# Altium project Sensorbox_Hub_ESP32.PrjPcb
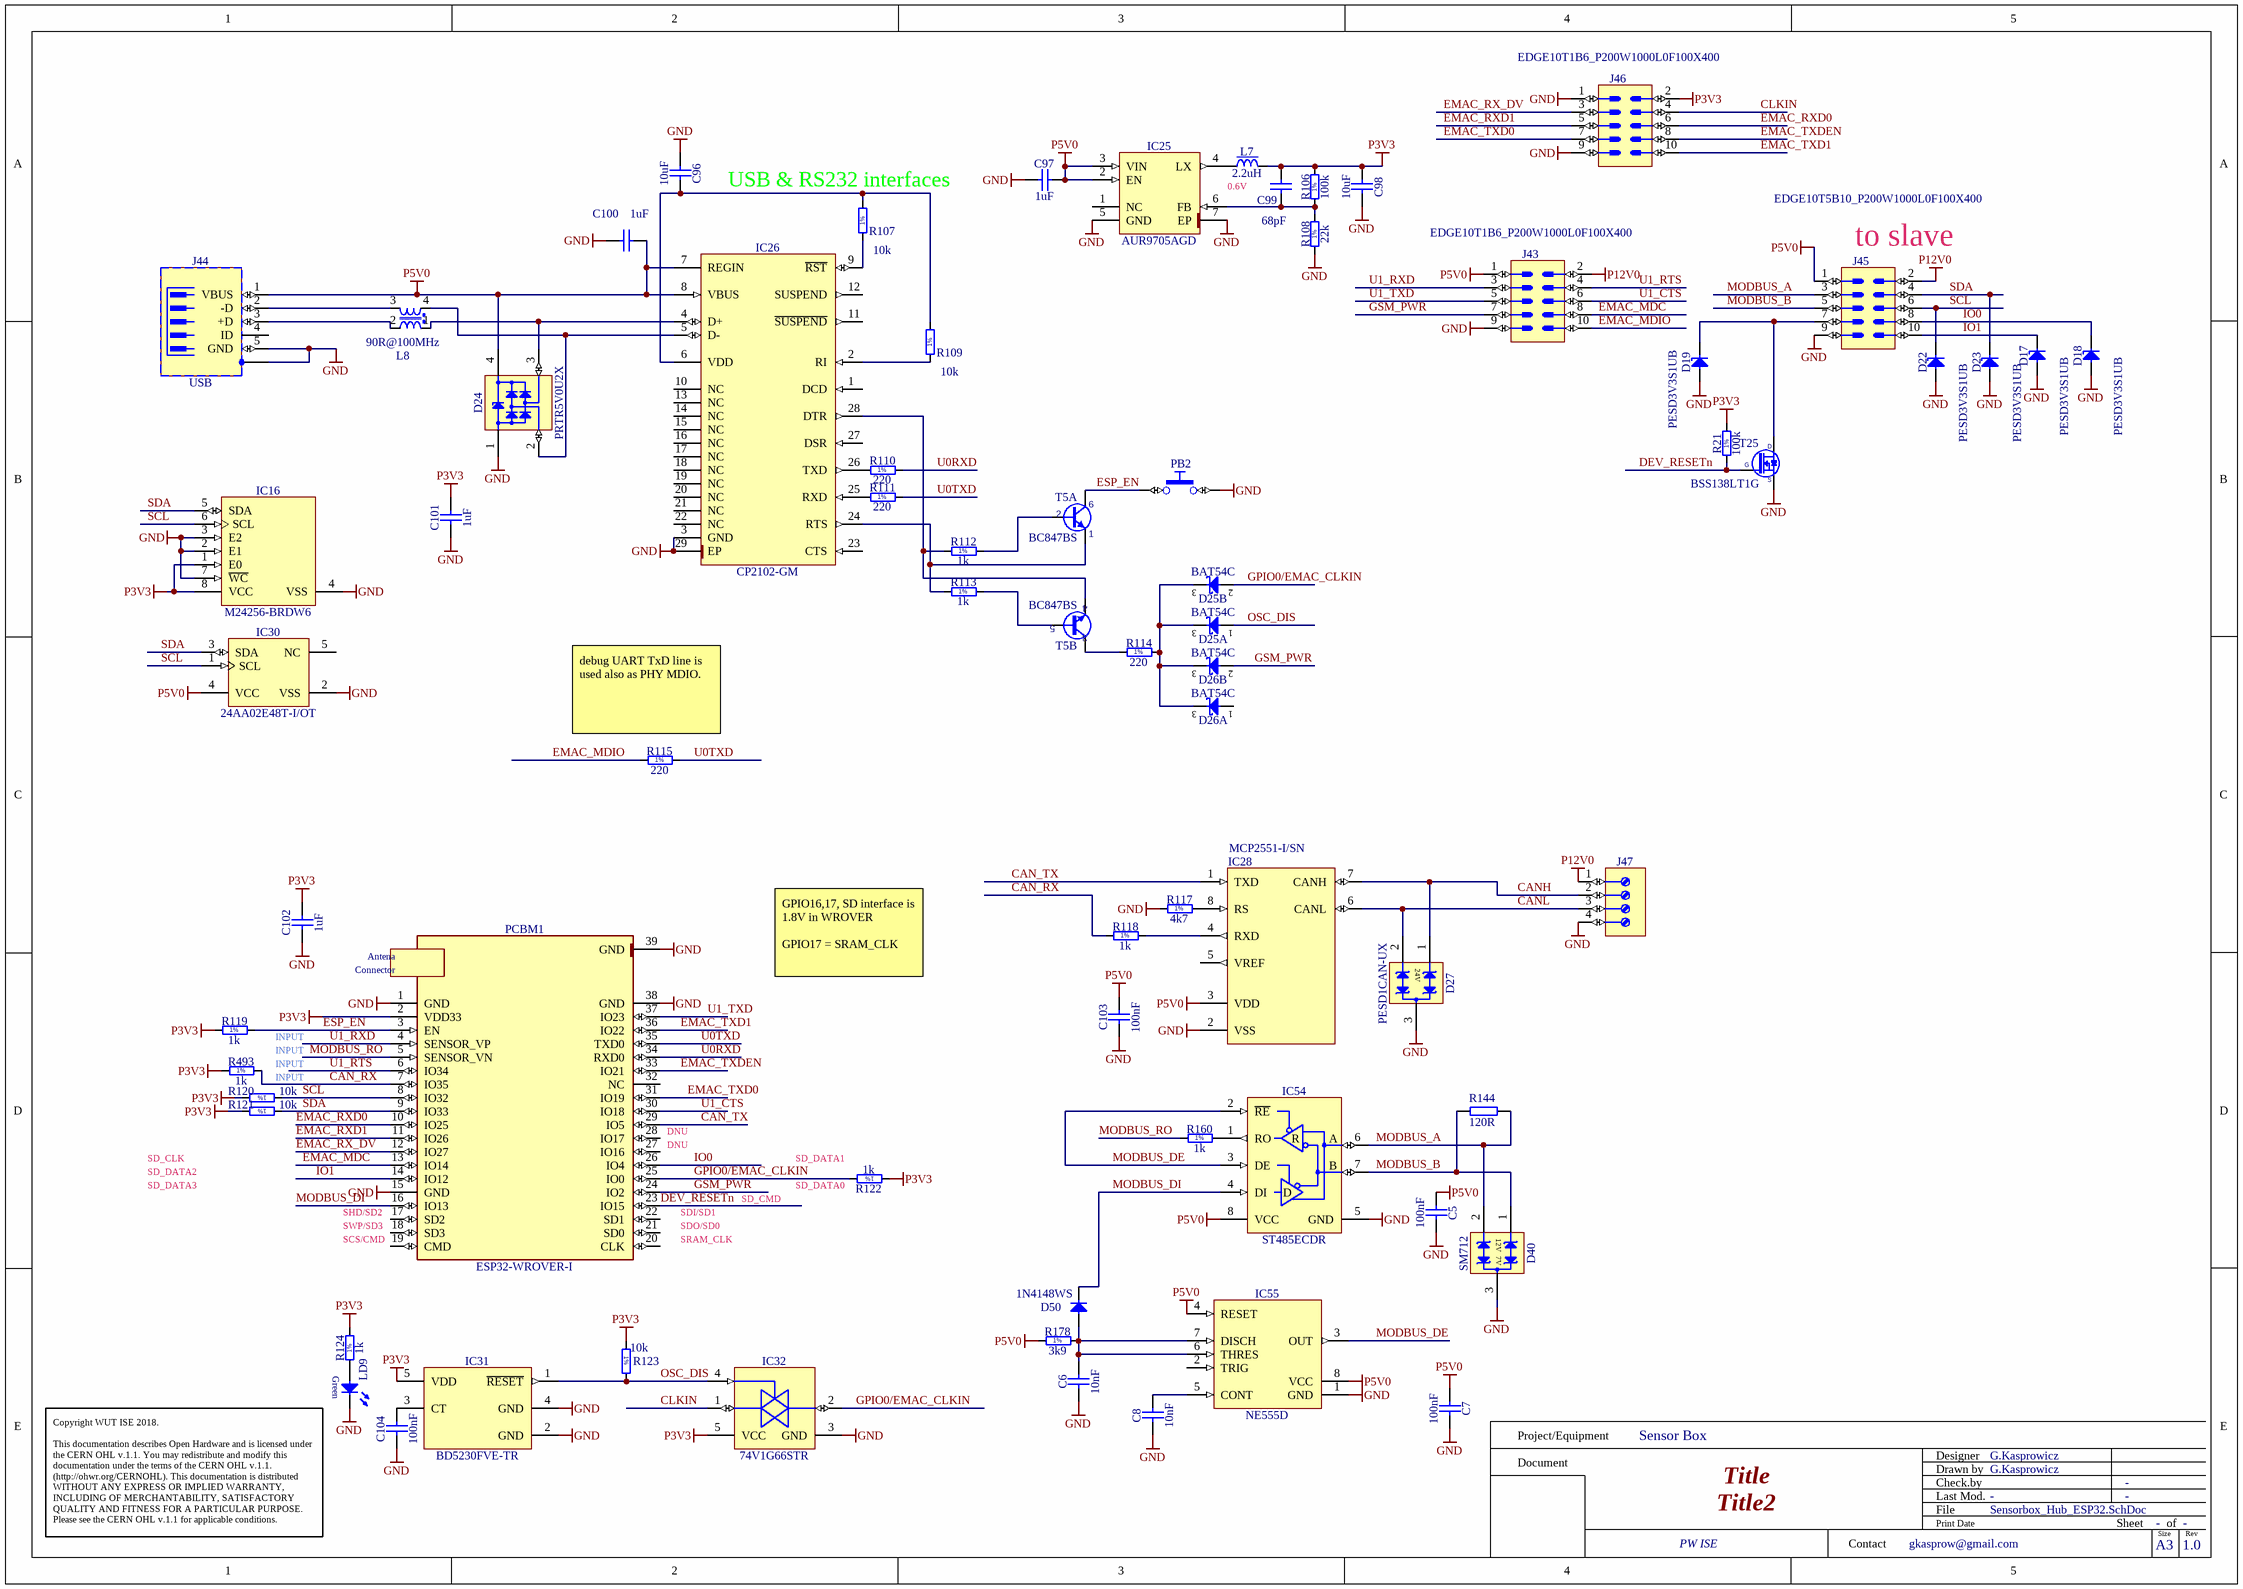
[diagram p0: Sensorbox_Hub_ESP32.SchDoc]
1 sheet, 68 parts. Net scope: global (net labels, ports and power ports of the same name join across sheets).
Board file: Sensorbox_Hub_ESP32.PCBDOC

## Sheet Sensorbox_Hub_ESP32.SchDoc: Title
size 420 x 297 mm; Author: G.Kasprowicz; CompanyName: WUT ISE; DrawnBy: G.Kasprowicz; Organization: WUT ISE; Address1: PW ISE; Address2: Nowowiejska 15/19 00-665 Warsaw; Address3: gkasprow@gmail.com; Revision: 1.0; SheetNumber: -; SheetTotal: -; ModifiedBy: -; CheckedDate: -; Title2: Title2; DivGrp: WUT ISE; Designer: G.Kasprowicz; ModifiedDate: -; ProjectName: Sensor Box

### Parts
C5  100nF  [CAPC1005X55N]
C6  10nF  [CAPC1608X87N]
C7  100nF  [CAPC1005X55N]
C8  10nF  [CAPC1608X87N]
C96  10uF  [CAPC2012X135N]
C97  1uF  [CAPC1005X55N]
C98  10uF  [CAPC2012X135N]
C99  68pF  [CAPC1608X87N]
C100  1uF  [CAPC1608X87N]
C101  1uF  [CAPC1005X55N]
C102  1uF  [CAPC1005X55N]
C103  100nF  [CAPC1005X55N]
C104  100nF  [CAPC1005X55N]
D17  PESD3V3S1UB  [SODFL1608X65N]
D18  PESD3V3S1UB  [SODFL1608X65N]
D19  PESD3V3S1UB  [SODFL1608X65N]
D22  PESD3V3S1UB  [SODFL1608X65N]
D23  PESD3V3S1UB  [SODFL1608X65N]
D24  PRTR5V0U2X  [SOT190P230X110-4N]
D25  BAT54C  [SOT95P240X130-3N]  (parts A,B of 2)
D26  BAT54C  [SOT95P240X130-3N]  (parts A,B of 2)
D27  PESD1CAN-UX  [SOT95P237X112-3N]
D40  SM712  [SOT95P237X112-3N]
D50  1N4148WS  [SODFL2512X100N]
IC16  M24256-BRDW6  [SOP65P640X120-8N]
IC25  AUR9705AGD  [SON65P200X200X80-7N-R65X145]
IC26  CP2102-GM  [QFN50P500X500X100-29N-S335]
IC28  MCP2551-I/SN  [SOIC127P600X175-8N]
IC30  24AA02E48T-I/OT  [SOT95P280X145-5N]
IC31  BD5230FVE-TR  [SOT95P280X145-5N]
IC32  74V1G66STR  [SOT95P280X145-5N]
IC54  ST485ECDR  [SOIC127P600X175-8N]
IC55  NE555D  [SOIC127P600X175-8N]
J43  (no value)  [EDGE10T1B6_P200W1000L0F100X400]
J44  USB  [MOLEX_105133-0011]
J45  (no value)  [EDGE10T5B10_P200W1000L0F100X400]
J46  (no value)  [EDGE10T1B6_P200W1000L0F100X400]
J47  (no value)  [PHOENIX_1725672]
L7  2.2uH  [IND_MURATA_LQH44PN_P0]
L8  90R@100MHz  [IND_MURATA_DLW21S]
LD9  Green  [LED_KINGBRIGHT_KPTR3216]  (value not drawn)
PB2  Push Button  [PB_TYCO_FSMSM]  (value not drawn)
PCBM1  ESP32-WROVER-I  [PCBM_ESP32-WROVER-I]
R21  100k  [RESC1005X40N]
R106  100k  [RESC1005X40N]
R107  10k  [RESC1005X40N]
R108  22k  [RESC1005X40N]
R109  10k  [RESC1005X40N]
R110  220  [RESC1005X40N]
R111  220  [RESC1005X40N]
R112  1k  [RESC1005X40N]
R113  1k  [RESC1005X40N]
R114  220  [RESC1005X40N]
R115  220  [RESC1005X40N]
R117  4k7  [RESC1005X40N]
R118  1k  [RESC1005X40N]
R119  1k  [RESC1005X40N]
R120  10k  [RESC1005X40N]
R121  10k  [RESC1005X40N]
R122  1k  [RESC1005X40N]
R123  10k  [RESC1005X40N]
R124  1k  [RESC1005X40N]
R144  120R  [1206R]
R160  1k  [RESC1005X40N]
R178  3k9  [RESC1005X40N]
R493  1k  [RESC1005X40N]
T5  BC847BS  [SOT65P210X110-6N]  (parts A,B of 2)
T25  BSS138LT1G  [SOT95P240X110-3N]

### Nets
GND: C5.2 C6.1 C7.2 C8.1 C96.1 C97.1 C98.2 C100.2 C101.1 C102.1 C103.1 C104.1 D17.2(A) D18.2(A) D19.2(A) D22.2(A) D23.2(A) D24.1(GND) D27.3(GND) D40.3(GND) IC16.2(E1) IC16.3(E2) IC16.4(VSS) IC16.7(~{WC}) IC25.5(GND) IC25.7(EP) IC26.3(GND) IC26.29(EP) IC28.2(VSS) IC30.2(VSS) IC31.2(GND) IC31.4(GND) IC32.3(GND) IC54.5(GND) IC55.1(GND) J43.9 J44.5(GND) J44.6(SH) J45.9 J46.1 J46.9 J47.4 LD9.1(C) PB2.2 PCBM1.1(GND) PCBM1.15(GND) PCBM1.38(GND) PCBM1.39(GND) R108.1 R117.1 T25.2(S)
P3V3: C98.1 C99.2 C101.2 C102.2 IC16.1(E0) IC16.8(VCC) IC31.5(VDD) IC32.5(VCC) J46.2 L7.2 PCBM1.2(VDD33) R21.2 R106.2 R119.1 R120.2 R121.2 R122.1 R123.1 R124.2 R493.1
P5V0: C5.1 C7.1 C97.2 C100.1 C103.2 D24.4(VCC) IC25.2(EN) IC25.3(VIN) IC26.7(REGIN) IC26.8(VBUS) IC28.3(VDD) IC30.4(VCC) IC54.8(VCC) IC55.4(RESET) IC55.8(VCC) J43.1 J44.1(VBUS) J45.1 R178.1
P12V0: J43.2 J45.2 J47.1
CAN_RX: PCBM1.7(IO35) R118.1 R493.2
CAN_TX: IC28.1(TXD) PCBM1.29(IO5)
CANH: D27.1(I/O1) IC28.7(CANH) J47.2
CANL: D27.2(I/O2) IC28.6(CANL) J47.3
CLKIN: IC32.1(D0) J46.4
DEV_RESETn: PCBM1.23(IO15) R21.1 T25.1(G)
EMAC_MDC: J43.8 PCBM1.13(IO14)
EMAC_MDIO: J43.10 R115.1
EMAC_RX_DV: J46.3 PCBM1.12(IO27)
EMAC_RXD0: J46.6 PCBM1.10(IO25)
EMAC_RXD1: J46.5 PCBM1.11(IO26)
EMAC_TXD0: J46.7 PCBM1.31(IO19)
EMAC_TXD1: J46.10 PCBM1.36(IO22)
EMAC_TXDEN: J46.8 PCBM1.33(IO21)
ESP_EN: PB2.1 PCBM1.3(EN) R119.2 T5.6(C)
GPIO0/EMAC_CLKIN: D25.2(A) IC32.2(~{D0}) PCBM1.25(IO0) R122.2
GSM_PWR: D26.2(A) J43.7 PCBM1.24(IO2)
IO0: D18.1(C) J45.8 PCBM1.26(IO4)
IO1: D17.1(C) J45.10 PCBM1.14(IO12)
MODBUS_A: D40.2(I/O2) IC54.6(A) J45.3 R144.2
MODBUS_B: D40.1(I/O1) IC54.7(B) J45.5 R144.1
MODBUS_DE: IC54.2(~{RE}) IC54.3(DE) IC55.3(OUT)
MODBUS_DI: D50.1(C) IC54.4(DI) PCBM1.16(IO13)
MODBUS_RO: PCBM1.5(SENSOR_VN) R160.1
OSC_DIS: D25.1(A) IC31.1(~{RESET}) IC32.4(~{D1}) R123.2
SCL: D22.1(C) IC16.6(SCL) IC30.1(SCL) J45.6 PCBM1.8(IO32) R120.1
SDA: D23.1(C) IC16.5(SDA) IC30.3(SDA) J45.4 PCBM1.9(IO33) R121.1
U0RXD: PCBM1.34(RXD0) R110.2
U0TXD: PCBM1.35(TXD0) R111.2 R115.2
U1_CTS: J43.6 PCBM1.30(IO18)
U1_RTS: J43.4 PCBM1.6(IO34)
U1_RXD: J43.3 PCBM1.4(SENSOR_VP)
U1_TXD: J43.5 PCBM1.37(IO23)
NetC6_2: C6.2 D50.2(A) IC55.6(THRES) IC55.7(DISCH) R178.2
NetC8_2: C8.2 IC55.5(CONT)
NetC96_2: C96.2 IC26.6(VDD) R107.2 R109.2
NetC99_1: C99.1 IC25.6(FB) R106.1 R108.2
NetC104_2: C104.2 IC31.3(CT)
NetD19_1: D19.1(C) J45.7 T25.3(D)
NetD24_2: D24.2(I/O1) IC26.5(D-) L8.4
NetD24_3: D24.3(I/O2) IC26.4(D+) L8.1
NetD25_3: D25.3(COMC) D26.3(COMC) R114.2
NetIC25_4: IC25.4(LX) L7.1
NetIC26_2: IC26.2(RI) R109.1
NetIC26_9: IC26.9(~{RST}) R107.1
NetIC26_24: IC26.24(RTS) R113.1 T5.1(E)
NetIC26_25: IC26.25(RXD) R111.1
NetIC26_26: IC26.26(TXD) R110.1
NetIC26_28: IC26.28(DTR) R112.1 T5.4(E)
NetIC28_4: IC28.4(RXD) R118.2
NetIC28_8: IC28.8(RS) R117.2
NetIC54_1: IC54.1(RO) R160.2
NetJ44_2: J44.2(-D) L8.3
NetJ44_3: J44.3(+D) L8.2
NetLD9_2: LD9.2(A) R124.1
NetR112_2: R112.2 T5.2(B)
NetR113_2: R113.2 T5.5(B)
NetR114_1: R114.1 T5.3(C)

Not connected (* = marked no-connect by the designer): D26 1(A); IC25 1(NC); IC26 1(DCD) 10(NC) 11(~{SUSPEND}) 12(SUSPEND) 13(NC) 14(NC) 15(NC) 16(NC) 17(NC) 18(NC) 19(NC) 20(NC) 21(NC) 22(NC) 23(CTS) 27(DSR); IC28 5(VREF); IC30 5(NC); IC55 2(TRIG); J44 4(ID); PCBM1 17(SD2) 18(SD3) 19(CMD) 20(CLK) 21(SD0) 22(SD1) 27(IO16) 28(IO17) 32(NC)

### Notes on the sheet
- (near R107) USB & RS232 interfaces
- 0.6V
- (near J45) to slave
- (near R115) debug UART TxD line is used also as PHY MDIO.
- GPIO16,17, SD interface is 1.8V in WROVER
  GPIO17 = SRAM_CLK
- INPUT
- (near PCBM1) DNU
- SD_DATA2
- SD_DATA3
- SD_CLK
- SD_CMD
- (near R122) SD_DATA0
- (near R122) SD_DATA1
- (near PCBM1) SCS/CMD
- (near PCBM1) SWP/SD3
- (near PCBM1) SHD/SD2
- (near PCBM1) SDO/SD0
- (near PCBM1) SRAM_CLK
- (near PCBM1) SDI/SD1
- Project/Equipment
- Document
- Designer
- Drawn by
- Check.by
- Copyright WUT ISE 2018.
  This documentation describes Open Hardware and is licensed under the CERN OHL v.1.1. You may redistribute and modify this documentation under the terms of the CERN OHL v.1.1. (http://ohwr.org/CERNOHL). This documentation is distributed WITHOUT ANY EXPRESS OR IMPLIED WARRANTY, INCLUDING OF MERCHANTABILITY, SATISFACTORY QUALITY AND FITNESS FOR A PARTICULAR PURPOSE. Please see the CERN OHL v.1.1 for applicable conditions.
- Contact
- File
- Last Mod.
- Print Date
- Sheet
- Size
- A3
- of
- Rev
- (in symbol PCBM_ESP32-WROVER-I) Antena; Connector
- (in symbol R0402_1K_1%_0.0625W_100PPM) 1%
- (in symbol R0402_3K9_1%_0.0625W_100PPM) 1%
- (in symbol R0402_4K7_1%_0.0625W_100PPM) 1%
- (in symbol R0402_10K_1%_0.0625W_100PPM) 1%
- (in symbol R0402_22K_1%_0.0625W_100PPM) 1%
- (in symbol R0402_100K_1%_0.0625W_100PPM) 1%
- (in symbol R0402_220R_1%_0.0625W_100PPM) 1%
- (in symbol SM712) 12V; 7V
- (in symbol ST485ECDR) R; D

### Library data of the parts
C5 C7 = CC0402_100NF_16V_10%_X7R: Non-polarised capacitor; Part Description: SMD Multilayer Chip Ceramic Capacitor; Manufacturer: GENERIC; Manufacturer1 Part Number: GRM155R71C104KA88D; Voltage: 16V; TC: X7R; Tolerance: ±10%; Part Number: CC0402_100NF_16V_10%_X7R; Component Kind: Standard; Component Type: Standard; Pin Count: 2; Value: 100nF; Status: Not Recommended; Manufacturer Part Number: CC0402_100NF_16V_10%_X7R; Case: 0402; Mounted: Yes; Socket: No; SMD: Yes; Manufacturer1 Example: MURATA; Manufacturer1 ComponentHeight: 0.55mm; HelpURL: \\cern.ch\dfs\Applications\Altium\Datasheets\CC0402_X7R_MURATA_GRM.pdf; Author: CERN DEM JLC; CreateDate: 05.12.2013; LatestRevisionDate: 03.12.2007; Sense: No
C6 C8 = CC0603_10NF_50V_5%_C0G: Non-polarised capacitor; Part Description: SMD Multilayer Chip Ceramic Capacitor; Manufacturer: GENERIC; Manufacturer1 Part Number: C1608C0G1H103J080AA; Voltage: 50V; TC: C0G/NP0; Tolerance: ±5%; Part Number: CC0603_10NF_50V_5%_C0G; Component Kind: Standard; Component Type: Standard; Pin Count: 2; Value: 10nF; Status: Preferred; Manufacturer Part Number: CC0603_10NF_50V_5%_C0G; Case: 0603; Mounted: Yes; Socket: No; SMD: Yes; Sense: No; Manufacturer1 Example: TDK; Manufacturer1 ComponentHeight: 0.9mm; HelpURL: \\cern.ch\dfs\Applications\Altium\Datasheets\CC0603_C0G_TDK_C.pdf; Author: CERN DEM JLC; CreateDate: 10.12.2014; LatestRevisionDate: 10.12.2014
C96 C98 = CC0805_10UF_16V_10%_X5R: Non-polarised capacitor; Part Description: SMD Multilayer Chip Ceramic Capacitor; Manufacturer: GENERIC; Manufacturer1 Part Number: C0805C106K4PAC; Voltage: 16V; TC: X5R; Tolerance: ±10%; Part Number: CC0805_10UF_16V_10%_X5R; Component Kind: Standard; Component Type: Standard; Pin Count: 2; Value: 10uF; Status: Preferred; Manufacturer Part Number: CC0805_10UF_16V_10%_X5R; Case: 0805; Mounted: Yes; Socket: No; SMD: Yes; Manufacturer1 Example: KEMET; Manufacturer1 ComponentHeight: 1.4mm; HelpURL: \\cern.ch\dfs\Applications\Altium\Datasheets\CC1206_X5R_KEMET.pdf; Author: CERN DEM JLC; CreateDate: 03.12.2007; LatestRevisionDate: 03.12.2007; Sense: No
C97 C101 C102 = CC0402_1UF_16V_10%_X5R: Non-polarised capacitor; Part Description: SMD Multilayer Chip Ceramic Capacitor; Manufacturer: GENERIC; Manufacturer1 Part Number: C1005X5R1C105KT; Voltage: 16V; TC: X5R; Tolerance: ±10%; Part Number: CC0402_1UF_16V_10%_X5R; Component Kind: Standard; Component Type: Standard; Pin Count: 2; Value: 1uF; Status: Preferred; Manufacturer Part Number: CC0402_1UF_16V_10%_X5R; Case: 0402; Mounted: Yes; Socket: No; SMD: Yes; Sense: No; Manufacturer1 Example: TDK; Manufacturer1 ComponentHeight: 0.55mm; HelpURL: \\cern.ch\dfs\Applications\Altium\Datasheets\CC0402_X5R_TDK_C.pdf; Author: CERN DEM JLC; CreateDate: 25.10.2012; LatestRevisionDate: 25.10.2012
C99 = CC0603_68PF_50V_5%_NP0: Non-polarised capacitor; Part Description: SMD Multilayer Chip Ceramic Capacitor; Manufacturer: GENERIC; Manufacturer1 Part Number: 223886715689; Voltage: 50V; TC: C0G/NP0; Tolerance: ±5%; Part Number: CC0603_68PF_50V_5%_NP0; Component Kind: Standard; Component Type: Standard; Pin Count: 2; Value: 68pF; Status: Preferred; Manufacturer Part Number: CC0603_68PF_50V_5%_NP0; Case: 0603; Mounted: Yes; Socket: No; SMD: Yes; Sense: No; Manufacturer1 Example: PHYCOMP; Manufacturer1 ComponentHeight: 0.87mm; HelpURL: \\cern.ch\dfs\Applications\Altium\Datasheets\CC0603_NP0_PHYCOMP.pdf; Author: CERN DEM JLC; CreateDate: 03.12.2007; LatestRevisionDate: 03.12.2007
C100 = CC0603_1UF_25V_10%_X7R: Non-polarised capacitor; Part Description: SMD Multilayer Chip Ceramic Capacitor; Manufacturer: GENERIC; Manufacturer1 Part Number: GRM188R71E105KA12D; Voltage: 25V; TC: X7R; Tolerance: ±10%; Table: Capacitors SMD; Part Number: CC0603_1UF_25V_10%_X7R; Component Kind: Standard; Component Type: Standard; Pin Count: 2; Value: 1uF; Status: None; Manufacturer Part Number: CC0603_1UF_25V_10%_X7R; Case: 0603; Mounted: Yes; Socket: No; SMD: Yes; Manufacturer1 Example: MURATA; Manufacturer1 ComponentHeight: 0.9mm; HelpURL: \\cern.ch\dfs\Applications\Altium\Datasheets\CC0603_X7R_MURATA.pdf; Author: CERN DEM JLC; CreateDate: 2011-01-18; LatestRevisionDate: 2011-01-18
C103 C104 = CC0402_100NF_16V_10%_X5R: Non-polarised capacitor; Part Description: SMD Multilayer Chip Ceramic Capacitor; Manufacturer: GENERIC; Manufacturer1 Part Number: GRM155R61C104KA88D; Voltage: 16V; TC: X5R; Tolerance: ±10%; Part Number: CC0402_100NF_16V_10%_X5R; Component Kind: Standard; Component Type: Standard; Pin Count: 2; Value: 100nF; Status: None; Manufacturer Part Number: CC0402_100NF_16V_10%_X5R; Case: 0402; Mounted: Yes; Socket: No; SMD: Yes; Sense: No; Manufacturer1 Example: MURATA; Manufacturer1 ComponentHeight: 0.55mm; HelpURL: \\cern.ch\dfs\Applications\Altium\Datasheets\CC0402_X5R_MURATA_GRM.pdf; Author: CERN DEM JLC; CreateDate: 10.12.2013; LatestRevisionDate: 10.12.2013
D17-D19 D22 D23 = PESD3V3S1UB: ESD protection diode; Part Description: ESD protection diode (23kV); Manufacturer: NXP SEMICONDUCTORS; Voltage: 3V3; Power: 330W; PressFit: No; Bonding: No; Part Number: PESD3V3S1UB; Component Kind: Standard; Component Type: Standard; Device: PESD3V3S1UB; PackageDescription: Ultra Small Outline Diode Flat Lead (SOD-523), Body; 1.2mm L X 0.8mm W X 0.65mm H, IPC Medium Density; Manufacturer Part Number: PESD3V3S1UB; Pin Count: 2; Case: SOD523; Mounted: Yes; Socket: No; SMD: Yes; Sense: No; ComponentHeight: 0.65mm; HelpURL: \\cern.ch\dfs\Applications\Altium\Datasheets\PESD3V3S1UB.pdf; Author: CERN DEM JLC; CreateDate: 29.11.2012; LatestRevisionDate: 29.11.2012
D24 = PRTR5V0U2X: Ultra Low Capacitance Double Rail-to-Rail ESD Protection Diode; Part Description: Ultra Low Capacitance (1pF) Double Rail-to-Rail ESD Protection Diode (8kV); Manufacturer: NXP SEMICONDUCTORS; Voltage: 5.5V; PressFit: No; Bonding: No; Table: Diodes; Part Number: PRTR5V0U2X; Component Kind: Standard; Component Type: Standard; Device: PRTR5V0U2X; PackageDescription: SOT143B, SOT, 1.90mm Pitch; 4 Pin, 1.30mm W X 2.90mm L X 1.10mm H body, IPC Medium Density; Manufacturer Part Number: PRTR5V0U2X; Pin Count: 4; Case: SOT143B; Mounted: Yes; Socket: No; SMD: Yes; ComponentHeight: 1.1mm; HelpURL: \\cern.ch\dfs\Applications\Altium\Datasheets\PRTR5V0U2X.pdf; Author: CERN DEM JLC; CreateDate: 2011-03-22; LatestRevisionDate: 2011-03-22
D25 D26 = BAT54C: Dual Common Cathode Schottky Diodes; Part Description: Dual Common Cathode Small Signal Schottky Diode; Manufacturer: FAIRCHILD SEMICONDUCTOR; Voltage: 30V; Power: 200mA; PressFit: No; Bonding: No; Part Number: BAT54C; Component Kind: Standard; Component Type: Standard; Device: BAT54C; PackageDescription: SOT23 3-Leads, Pitch 0.95mm - Body 1.3x2.9mm, IPC Medium Density; Manufacturer Part Number: BAT54C; Pin Count: 3; Case: SOT23-3; Mounted: Yes; Socket: No; SMD: Yes; Sense: No; ComponentHeight: 1.30mm; HelpURL: \\cern.ch\dfs\Applications\Altium\Datasheets\BAT54C.pdf; Author: CERN DEM JLC; CreateDate: 17.09.2009; LatestRevisionDate: 27.05.2010
D27 = D_TVS_PESD1CAN: TVS Diode for CAN; Manufacturer: Nexperia; Voltage: 24V; Power: 400W; PressFit: No; Bonding: No; Part Number: PESD1CAN-UX; Component Kind: Standard; Component Type: Standard; Device: PESD1CAN-UX; PackageDescription: SOT, 0.95mm, pitch; 3 pin,1.30mm W X 2.92mm L X 1.12mm H body, IPC Medium Density; Part Description: TVS Diode for CAN; Manufacturer Part Number: PESD1CAN-UX; Pin Count: 3; Case: SOT-23; Mounted: Yes; Socket: No; SMD: Yes; Sense: No; ComponentHeight: 1.12mm; HelpURL: \\cern.ch\dfs\Applications\Altium\Datasheets\SM712.TCT.pdf; Author: CERN DEM JLC; CreateDate: 03.09.2014; LatestRevisionDate: 13.01.2015
D40 = SM712: Asymmetrical TVS Diode for Extended Common-Mode RS-485; Manufacturer: SEMTECH; Voltage: 12V/-7V; Power: 400W; PressFit: No; Bonding: No; Part Number: SM712; Component Kind: Standard; Component Type: Standard; Device: SM712; PackageDescription: SOT, 0.95mm, pitch; 3 pin,1.30mm W X 2.92mm L X 1.12mm H body, IPC Medium Density; Status: Obsolete; Part Description: Asymmetrical TVS Diode for Extended Common-Mode RS-485; Manufacturer Part Number: SM712; Pin Count: 3; Case: SOT-23; Mounted: Yes; Socket: No; SMD: Yes; Sense: No; ComponentHeight: 1.12mm; HelpURL: \\cern.ch\dfs\Applications\Altium\Datasheets\SM712.pdf; Author: CERN DEM JLC; CreateDate: 23.04.2012; LatestRevisionDate: 23.04.2012
D50 = 1N4148WS: Diode; Part Description: Small Signal Diodes; Manufacturer: FAIRCHILD SEMICONDUCTOR; Voltage: 75V; Power: 150mA; PressFit: No; Bonding: No; Part Number: 1N4148WS; Component Kind: Standard; Component Type: Standard; Device: 1N4148WS; PackageDescription: SODFL Diode; 1.70mm W X 1.25mm L X 1.00mm H body, IPC Medium Density; Manufacturer Part Number: 1N4148WS; Pin Count: 2; Case: SOD-323F; Mounted: Yes; Socket: No; SMD: Yes; Sense: No; ComponentHeight: 1mm; HelpURL: \\cern.ch\dfs\Applications\Altium\Datasheets\1N4148WS.pdf; Author: CERN DEM JLC; CreateDate: 12.05.2011; LatestRevisionDate: 12.05.2011
IC16 = MEM_M24256-BRDW6P: 256-Kbit Serial I²C Bus EEPROM; Manufacturer: ST MICROELECTRONICS; PressFit: No; Bonding: No; Part Number: M24256-BRDW6P; Component Kind: Standard; Component Type: Standard; Device: M24256-BRDW6; PackageDescription: SOP, 0.65mm pitch; 8 pin, 4.40mm W X 3.00mm L X 1.20mm H body, IPC Medium Density; Part Description: 256-Kbit Serial I²C Bus EEPROM; Manufacturer Part Number: M24256-BRDW6; Pin Count: 8; Case: TSSOP8; Mounted: Yes; Socket: No; SMD: Yes; Sense: No; ComponentHeight: 1.2mm; HelpURL: \\cern.ch\dfs\Applications\Altium\Datasheets\M24256-BRDW6P.pdf; Author: CERN DEM MR; CreateDate: 17.03.2016; LatestRevisionDate: 17.03.2016
IC25 = AUR9705AGD: 0V to 6V Input, 1A, 1.5MHz, Step-Down DC-DC Converter; Manufacturer: DIODES INCORPORATED; PressFit: No; Bonding: No; Part Number: AUR9705AGD; Component Kind: Standard; Component Type: Standard; Device: AUR9705AGD; PackageDescription: SON, 0.65mm Pitch, 6 Pin, 2.00mm W X 2.00mm L X 0.80mm H body (W/Thermal Tab 0.65mm X 1.45mm), IPC Medium Density; Part Description: 0V to 6V Input, 1A, 1.5MHz, Step-Down DC-DC Converter; Manufacturer Part Number: AUR9705AGD; Pin Count: 7; Case: SON6; Mounted: Yes; Socket: No; SMD: Yes; Sense: No; ComponentHeight: 0.8mm; HelpURL: \\cern.ch\dfs\Applications\Altium\Datasheets\AUR9705AGD.pdf; Author: CERN DEM MR; CreateDate: 15.02.2018; LatestRevisionDate: 15.02.2018
IC26 = CP2102-GM: Single-Chip USB to UART Bridge; Manufacturer: SILICON LABS; Table: Analog & Interface; Part Number: CP2102-GM; Component Kind: Standard; Component Type: Standard; Device: CP2102-GM; PackageDescription: QFN, 0.50mm Pitch, Square; 28 pin, 5.00mm L X 5.00mm W X 1.00mm H body (w/thermal tab 3.35 X 3.35mm),  IPC Medium Density; Part Description: Single-Chip USB to UART Bridge; Manufacturer Part Number: CP2102-GM; Pin Count: 29; Case: QFN28; Mounted: Yes; Socket: No; SMD: Yes; ComponentHeight: 1.0mm; Author: CERN DEM JLC; HelpURL: \\cern.ch\dfs\Applications\Altium\Datasheets\CP2102-GM.pdf; CreateDate: 2011-03-03; LatestRevisionDate: 2011-03-03
IC28 = IFC_MCP2551: High-Speed CAN Transceiver, 8-Pin SOIC, Industrial Temperature; Manufacturer: MICROCHIP TECHNOLOGY; PressFit: No; Bonding: No; Part Number: MCP2551-I/SN; Component Kind: Standard; Component Type: Standard; Device: MCP2551-I/SN; PackageDescription: SOIC 8, Pitch 1.27mm - Body 4x5mm, IPC Medium Density; Part Description: High-Speed CAN Transceiver; Manufacturer Part Number: MCP2551-I/SN; Pin Count: 8; Case: SOIC8; Mounted: Yes; Socket: No; SMD: Yes; Sense: No; ComponentHeight: 1.75mm; Author: GK; CreateDate: 07.09.2016; LatestRevisionDate: 07.09.2016
IC30 = 24AA02E48T-I/OT: 1.7V-5.5V, 2K I2C Serial EEPROM With EUI-48 Node Identity; Manufacturer: MICROCHIP TECHNOLOGY; PressFit: No; Bonding: No; Part Number: 24AA02E48T-I/OT; Component Kind: Standard; Component Type: Standard; Device: 24AA02E48T-I/OT; PackageDescription: SOT, 0.95mm pitch; 5 pin, 1.60mm W X 2.90mm L X 1.45mm H body, IPC Medium Density; Part Description: 1.7V-5.5V, 2K I2C Serial EEPROM With EUI-48 Node Identity; Manufacturer Part Number: 24AA02E48T-I/OT; Pin Count: 5; Case: SOT23-5; Mounted: Yes; Socket: No; SMD: Yes; Sense: No; ComponentHeight: 1.45mm; HelpURL: \\cern.ch\dfs\Applications\Altium\Datasheets\24AA02E48T-I-OT.pdf; Author: CERN DEM MR; CreateDate: 31.03.2016; LatestRevisionDate: 31.03.2016
IC31 = VMON_BD5230FVE-TR: Free Delay Time Setting  CMOS Voltage Detector; Part Description: 5V, Low Quiescent Current, Programmable-Delay Supervisory Circuit; Manufacturer: Rohm; PressFit: No; Bonding: No; Part Number: BD5230FVE-TR; Component Kind: Standard; Component Type: Standard; Device: BD5230FVE-TR; PackageDescription: SOT23, 5-Leads, Body 1.6x3.0mm, Pitch 0.95mm, IPC Medium Density; Manufacturer Part Number: BD5230FVE-TR; Pin Count: 5; Case: SOT23-5; Mounted: Yes; Socket: No; SMD: Yes; Sense: No; ComponentHeight: 1.45mm; Author: GK; HelpURL: \\cern.ch\dfs\Applications\Altium\Datasheets\TPS3808G50DBVT.pdf; CreateDate: 02.03.2015; LatestRevisionDate: 02.03.2015
IC32 = 74V1G66STR: Single Bilateral Switch; Manufacturer: ST MICROELECTRONICS; PressFit: No; Bonding: No; Part Number: 74V1G66STR; Component Kind: Standard; Component Type: Standard; Device: 74V1G66STR; PackageDescription: SOT, 0.95mm pitch; 5 pin, 1.60mm W X 2.90mm L X 1.45mm H body, IPC Medium Density; Part Description: Single Bilateral Switch; Manufacturer Part Number: 74V1G66STR; Pin Count: 5; Case: SOT23-5; Mounted: Yes; Socket: No; SMD: Yes; Sense: No; ComponentHeight: 1.45mm; Author: CERN DEM JLC; HelpURL: \\cern.ch\dfs\Applications\Altium\Datasheets\74V1G66STR.pdf; CreateDate: 20.01.2014; LatestRevisionDate: 20.01.2014
IC54 = ST485ECDR: ±15kV ESD-Protected, Low Power  RS-485/RS-422 Transceiver; Manufacturer: ST MICROELECTRONICS; PressFit: No; Bonding: No; Part Number: ST485ECDR; Component Kind: Standard; Component Type: Standard; Device: ST485ECDR; PackageDescription: SOIC 8, Pitch 1.27mm - Body 4x5mm, IPC Medium Density; Part Description: ±15kV ESD-Protected, Low Power  RS-485/RS-422 Transceiver; Manufacturer Part Number: ST485ECDR; Pin Count: 8; Case: SOIC8; Mounted: Yes; Socket: No; SMD: Yes; Sense: No; ComponentHeight: 1.75mm; Author: CERN DEM MR; HelpURL: \\cern.ch\dfs\Applications\Altium\Datasheets\ST485ECDR.pdf; CreateDate: 15.02.2018; LatestRevisionDate: 15.02.2018
IC55 = NE555D: Precision Timer; Manufacturer: TEXAS INSTRUMENTS; PressFit: No; Bonding: No; Part Number: NE555D; Component Kind: Standard; Component Type: Standard; Device: NE555D; PackageDescription: SOIC 8, Pitch 1.27mm, Body 4x5mm, IPC Medium Density; Part Description: Precision Timer; Manufacturer Part Number: NE555D; Pin Count: 8; Case: SOIC8; Mounted: Yes; Socket: No; SMD: Yes; Sense: No; ComponentHeight: 1.75mm; Author: CERN DEM JMW; HelpURL: \\cern.ch\dfs\Applications\Altium\Datasheets\NE555D.pdf; CreateDate: 16.04.2009; LatestRevisionDate: 16.04.2009
J43 J46 = EDGE10T1B6_P200W1000L0F100X400: PCB Edge Connector 10 (2x5); Part Description: 10 Contacts Board Edge Connector, Pitch 2mm, Length 0mm, Width 10mm, Finger Lenght 4mm, Finger Width 1mm; Mounted: No; PressFit: No; Part Number: EDGE10T1B6_P200W1000L0F100X400; Component Kind: Standard (No BOM); Component Type: Standard (No BOM); Pin Count: 10; Socket: No; SMD: No; Sense: No; Status: None; ComponentHeight: 0mm; HelpURL: \\cern.ch\dfs\Applications\Altium\Datasheets\EDGE10T1B6_P200W1000L0F100X400.pdf; Author: CERN DEM MR; CreateDate: 14.02.2018; LatestRevisionDate: 14.02.2018
J44 = MOLEX_105133-0011: 5 Pin + 1 Shield USB Receptacle; Part Description: 0.65mm Pitch, Micro-USB Type B Surface Mounte Vertical Receptacle; Manufacturer: MOLEX; PressFit: No; Part Number: MOLEX_105133-0011; Component Kind: Standard; Component Type: Standard; Pin Count: 8; Family: USB; Mounted: Yes; Socket: No; SMD: Yes; Sense: No; Status: None; Manufacturer Part Number: 105133-0011; ComponentHeight: 6.7mm; HelpURL: \\cern.ch\dfs\Applications\Altium\Datasheets\MOLEX_105133-0011.pdf; Author: CERN DEM MR; CreateDate: 13.12.2017; LatestRevisionDate: 13.12.2017
J45 = EDGE10T5B10_P200W1000L0F100X400: PCB Edge Connector 10 (2x5); Part Description: 10 Contacts Board Edge Connector, Pitch 2mm, Length 0mm, Width 10mm, Finger Lenght 4mm, Finger Width 1mm; Mounted: No; PressFit: No; Part Number: EDGE10T5B10_P200W1000L0F100X400; Component Kind: Standard (No BOM); Component Type: Standard (No BOM); Pin Count: 10; Socket: No; SMD: No; Sense: No; Status: None; ComponentHeight: 0mm; HelpURL: \\cern.ch\dfs\Applications\Altium\Datasheets\EDGE10T5B10_P200W1000L0F100X400.pdf; Author: CERN DEM MR; CreateDate: 14.02.2018; LatestRevisionDate: 14.02.2018
J47 = PHOENIX_1725672: Terminal Block, 4 Positions, Screw Connection; Part Description: 6A, 63V, Terminal Block, Pitch 2.54mm, 4 Positions, Screw Connection; Manufacturer: PHOENIX CONTACT; Manufacturer Part Number: 1725672 (MPT 0,5/4-2,54); PressFit: No; Part Number: PHOENIX_1725672; Component Kind: Standard; Component Type: Standard; Pin Count: 4; Mounted: Yes; Socket: No; SMD: No; Sense: No; Status: None; ComponentHeight: 8.5mm; HelpURL: \\cern.ch\dfs\Applications\Altium\Datasheets\PHOENIX_1725672.pdf; Author: CERN DEM JMW; CreateDate: 07.11.2008; LatestRevisionDate: 26.04.2010
L7 = IND_2.2UH_20%_MURATA_LQH44PN2R2MP0L: Inductor With Core; Part Description: Wire Wound Ferrite Inductor for Power Lines; Manufacturer: MURATA; Power: 1.8A; Resistance: 0R049; Tolerance: ±20%; Part Number: IND_2.2UH_20%_MURATA_LQH44PN2R2MP0L; Component Kind: Standard; Component Type: Standard; Pin Count: 2; Value: 2.2uH; Status: None; Manufacturer Part Number: LQH44PN2R2MP0L; Case: 4040; Mounted: Yes; Socket: No; SMD: Yes; Sense: No; ComponentHeight: 1.8mm; HelpURL: \\cern.ch\dfs\Applications\Altium\Datasheets\IND_MURATA_LQH44PN_P0.pdf; Author: CERN DEM JLC; CreateDate: 14.02.2018; LatestRevisionDate: 14.02.2018
L8 = IND_MURATA_DLW21SN900SQ2L: Inductor Common Mode; Part Description: Wire Wound Common Mode Choke Coil (DLW21S Series); Manufacturer: MURATA; Power: 330mA; Resistance: 0.35R; Tolerance: ±25%; Table: Inductors SMD; Part Number: IND_MURATA_DLW21SN900SQ2L; Component Kind: Standard; Component Type: Standard; Pin Count: 4; Value: 90R@100MHz; Status: None; Manufacturer Part Number: DLW21SN900SQ2L; Case: 0805; Mounted: Yes; Socket: No; SMD: Yes; ComponentHeight: 1.4mm; HelpURL: \\cern.ch\dfs\Applications\Altium\Datasheets\IND_MURATA_DLW21S.pdf; Author: CERN DEM JLC; CreateDate: 2014-07-01; LatestRevisionDate: 2014-07-01
LD9 = LED_KINGBRIGHT_KPTR-3216CGCK: LED Green 1A 2C; Part Description: Reverse Mount LED 1.4x1.6mm Green; PressFit: No; Bonding: No; Part Number: LED_KINGBRIGHT_KPTR-3216CGCK; Component Kind: Standard; Component Type: Standard; Color: Green; PackageDescription: Reverse Mount LED 3216, Hole 2.1x2.3mm 0.35mm Height; Manufacturer: KINGBRIGHT; Manufacturer Part Number: KPTR-3216CGCK; Pin Count: 2; Mounted: Yes; Socket: No; SMD: Yes; Sense: No; ComponentHeight: 0.35mm; HelpURL: \\cern.ch\dfs\Applications\Altium\Datasheets\LED_KINGBRIGHT_KPTR-3216CGCK.pdf; Author: CERN DEM MR; CreateDate: 15.02.2016; LatestRevisionDate: 15.02.2016
PB2 = PB_TYCO_FSMSM: Push-Button Switch SPDT; Part Description: 12VDC 50mA SPST Tactile  Push-Button Switch; Manufacturer: TYCO ELECTRONICS; Manufacturer Part Number: FSMSM or 1437566-3; PressFit: No; Part Number: PB_TYCO_FSMSM; Component Kind: Standard; Component Type: Standard; Pin Count: 2; PackageDescription: Body 3.5x6.0mm, Pushbutton Switch,  TYCO ALCOSWITCH FSMSM Serie; Family: Push Button; Mounted: Yes; Socket: No; SMD: Yes; Sense: No; Status: None; ComponentHeight: 4.3mm; HelpURL: \\cern.ch\dfs\Applications\Altium\Datasheets\PB_TYCO_FSMSM.pdf; Author: CERN DEM JLC; CreateDate: 30.06.2008; LatestRevisionDate: 21.06.2012
PCBM1 = PCBM_ESP32-WROVER-I: Generic WiFi-BT-BLE MCU Module; Part Description: Generic WiFi-BT-BLE MCU Module (IPEX antenna, 32-Mbit PSRAM); Manufacturer: ESPRESSIF; PressFit: No; Bonding: No; Part Number: PCBM_ESP32-WROVER-I; Component Kind: Standard; Component Type: Standard; Device: ESP32-WROVER-I; PackageDescription: Generic WiFi-BT-BLE MCU Module (IPEX antenna) ,Body 18.00mm x 31.4mm; Manufacturer Part Number: ESP32-WROVER-I; Pin Count: 39; Mounted: Yes; Socket: No; SMD: Yes; Sense: No; ComponentHeight: 3.65mm; Author: CERN DEM JLC; HelpURL: \\cern.ch\dfs\Applications\Altium\Datasheets\PCBM_ESP32-WROVER-I.pdf; CreateDate: 14.11.2017; LatestRevisionDate: 14.11.2017
R21 R106 = R0402_100K_1%_0.0625W_100PPM: Resistor - 1%; Part Description: General Purpose Thick Film Chip Resistor; Manufacturer: GENERIC; Manufacturer1 Part Number: 232270671004L; TC: ±100ppm/°C; PressFit: No; Part Number: R0402_100K_1%_0.0625W_100PPM; Component Kind: Standard; Component Type: Standard; Pin Count: 2; Value: 100k; Status: Not Recommended; Power: 0.0625W; Tolerance: ±1%; Manufacturer Part Number: R0402_100K_1%_0.0625W_100PPM; Case: 0402; Mounted: Yes; Sense: No; Socket: No; SMD: Yes; Manufacturer1 Example: YAGEO PHYCOMP; Manufacturer1 ComponentHeight: 0.4mm; HelpURL: \\cern.ch\dfs\Applications\Altium\Datasheets\R0402_Phycomp_RC0402.pdf; Author: CERN DEM JLC; CreateDate: 03.12.2007; LatestRevisionDate: 17.10.2012
R107 R109 R120 R121 R123 = R0402_10K_1%_0.0625W_100PPM: Resistor - 1%; Part Description: General Purpose Thick Film Chip Resistor; Manufacturer: GENERIC; Manufacturer1 Part Number: 232270671003L; TC: ±100ppm/°C; Table: Resistors SMD; Part Number: R0402_10K_1%_0.0625W_100PPM; Component Kind: Standard; Component Type: Standard; Pin Count: 2; Value: 10k; Status: Not recommended; Power: 0.0625W; Tolerance: ±1%; Manufacturer Part Number: R0402_10K_1%_0.0625W_100PPM; Case: 0402; Mounted: Yes; Socket: No; SMD: Yes; Manufacturer1 Example: YAGEO PHYCOMP; Manufacturer1 ComponentHeight: 0.4mm; HelpURL: \\cern.ch\dfs\Applications\Altium\Datasheets\R0402_Phycomp_RC0402.pdf; Author: CERN DEM JLC; CreateDate: 2007-12-03; LatestRevisionDate: 2012-10-17
R108 = R0402_22K_1%_0.0625W_100PPM: Resistor - 1%; Part Description: General Purpose Thick Film Chip Resistor; Manufacturer: GENERIC; Manufacturer1 Part Number: 232270672203L; TC: ±100ppm/°C; PressFit: No; Part Number: R0402_22K_1%_0.0625W_100PPM; Component Kind: Standard; Component Type: Standard; Pin Count: 2; Value: 22k; Status: Not Recommended; Power: 0.0625W; Tolerance: ±1%; Manufacturer Part Number: R0402_22K_1%_0.0625W_100PPM; Case: 0402; Mounted: Yes; Sense: No; Socket: No; SMD: Yes; Manufacturer1 Example: YAGEO PHYCOMP; Manufacturer1 ComponentHeight: 0.4mm; HelpURL: \\cern.ch\dfs\Applications\Altium\Datasheets\R0402_Phycomp_RC0402.pdf; Author: CERN DEM JLC; CreateDate: 03.12.2007; LatestRevisionDate: 17.10.2012
R110 R111 R114 R115 = R0402_220R_1%_0.0625W_100PPM: Resistor - 1%; Part Description: General Purpose Thick Film Chip Resistor; Manufacturer: GENERIC; Manufacturer1 Part Number: 232270672201L; TC: ±100ppm/°C; PressFit: No; Part Number: R0402_220R_1%_0.0625W_100PPM; Component Kind: Standard; Component Type: Standard; Pin Count: 2; Value: 220; Status: Not Recommended; Power: 0.0625W; Tolerance: ±1%; Manufacturer Part Number: R0402_220R_1%_0.0625W_100PPM; Case: 0402; Mounted: Yes; Sense: No; Socket: No; SMD: Yes; Manufacturer1 Example: YAGEO PHYCOMP; Manufacturer1 ComponentHeight: 0.4mm; HelpURL: \\cern.ch\dfs\Applications\Altium\Datasheets\R0402_Phycomp_RC0402.pdf; Author: CERN DEM JLC; CreateDate: 03.12.2007; LatestRevisionDate: 17.10.2012
R112 R113 R118 R119 R122 R124 R160 R493 = R0402_1K_1%_0.0625W_100PPM: Resistor - 1%; Part Description: General Purpose Thick Film Chip Resistor; Manufacturer: GENERIC; Manufacturer1 Part Number: 232270671002L; TC: ±100ppm/°C; PressFit: No; Part Number: R0402_1K_1%_0.0625W_100PPM; Component Kind: Standard; Component Type: Standard; Pin Count: 2; Value: 1k; Status: Not Recommended; Power: 0.0625W; Tolerance: ±1%; Manufacturer Part Number: R0402_1K_1%_0.0625W_100PPM; Case: 0402; Mounted: Yes; Sense: No; Socket: No; SMD: Yes; Manufacturer1 Example: YAGEO PHYCOMP; Manufacturer1 ComponentHeight: 0.4mm; HelpURL: \\cern.ch\dfs\Applications\Altium\Datasheets\R0402_Phycomp_RC0402.pdf; Author: CERN DEM JLC; CreateDate: 03.12.2007; LatestRevisionDate: 17.10.2012
R117 = R0402_4K7_1%_0.0625W_100PPM: Resistor - 1%; Part Description: General Purpose Thick Film Chip Resistor; Manufacturer: GENERIC; Manufacturer1 Part Number: 232270674702L; TC: ±100ppm/°C; PressFit: No; Part Number: R0402_4K7_1%_0.0625W_100PPM; Component Kind: Standard; Component Type: Standard; Pin Count: 2; Value: 4k7; Status: Not Recommended; Power: 0.0625W; Tolerance: ±1%; Manufacturer Part Number: R0402_4K7_1%_0.0625W_100PPM; Case: 0402; Mounted: Yes; Sense: No; Socket: No; SMD: Yes; Manufacturer1 Example: YAGEO PHYCOMP; Manufacturer1 ComponentHeight: 0.4mm; HelpURL: \\cern.ch\dfs\Applications\Altium\Datasheets\R0402_Phycomp_RC0402.pdf; Author: CERN DEM JLC; CreateDate: 03.12.2007; LatestRevisionDate: 17.10.2012
R144 = RES_1206: SMD Resistor; Supplier 1: Newark; Supplier Part Number 1: 39K0871
R178 = R0402_3K9_1%_0.0625W_100PPM: Resistor - 1%; Part Description: General Purpose Thick Film Chip Resistor; Manufacturer: GENERIC; Manufacturer1 Part Number: 232270673902L; TC: ±100ppm/°C; PressFit: No; Part Number: R0402_3K9_1%_0.0625W_100PPM; Component Kind: Standard; Component Type: Standard; Pin Count: 2; Value: 3k9; Status: Not Recommended; Power: 0.0625W; Tolerance: ±1%; Manufacturer Part Number: R0402_3K9_1%_0.0625W_100PPM; Case: 0402; Mounted: Yes; Sense: No; Socket: No; SMD: Yes; Manufacturer1 Example: YAGEO PHYCOMP; Manufacturer1 ComponentHeight: 0.4mm; HelpURL: \\cern.ch\dfs\Applications\Altium\Datasheets\R0402_Phycomp_RC0402.pdf; Author: CERN DEM JLC; CreateDate: 03.12.2007; LatestRevisionDate: 17.10.2012
T5 = BC847BS: 45V 100mA Dual NPN General-Purpose Transistor; Manufacturer: NXP SEMICONDUCTORS; PressFit: No; Bonding: No; Part Number: BC847BS; Component Kind: Standard; Component Type: Standard; Device: BC847BS; PackageDescription: SOT363, SC-88, SOT, 0.65mm Pitch, 6 pin, 1.25mm W X 2.00mm L X 1.10mm H, IPC Medium Density; Part Description: 45V 100mA Dual NPN General-Purpose Transistor; Manufacturer Part Number: BC847BS; Pin Count: 6; Case: SOT363; Mounted: Yes; Socket: No; SMD: Yes; Sense: No; ComponentHeight: 1.1mm; HelpURL: \\cern.ch\dfs\Applications\Altium\Datasheets\BC847BS.pdf; Author: CERN DEM JMW; CreateDate: 10.07.2015; LatestRevisionDate: 10.07.2015
T25 = BSS138LT1G: N-CHANNEL MOSFET WITH DIODE; Part Description: 50V 200mA N-Channel Enhancement Mode Field-Effect Transistor; Manufacturer: ON SEMICONDUCTOR; PressFit: No; Bonding: No; Part Number: BSS138LT1G; Component Kind: Standard; Component Type: Standard; Device: BSS138LT1G; PackageDescription: SOT23 3-Leads, Pitch 0.95mm - Body 1.4x3mm, IPC Medium Density; Manufacturer Part Number: BSS138LT1G; Pin Count: 3; Case: SOT23-3; Mounted: Yes; Socket: No; SMD: Yes; Sense: No; ComponentHeight: 1.11mm; HelpURL: \\cern.ch\dfs\Applications\Altium\Datasheets\BSS138LT1G.pdf; Author: CERN DEM JLC; CreateDate: 23.03.2009; LatestRevisionDate: 23.03.2009